# EAGLE design BUZZI-30 (EAGLE 4.15)
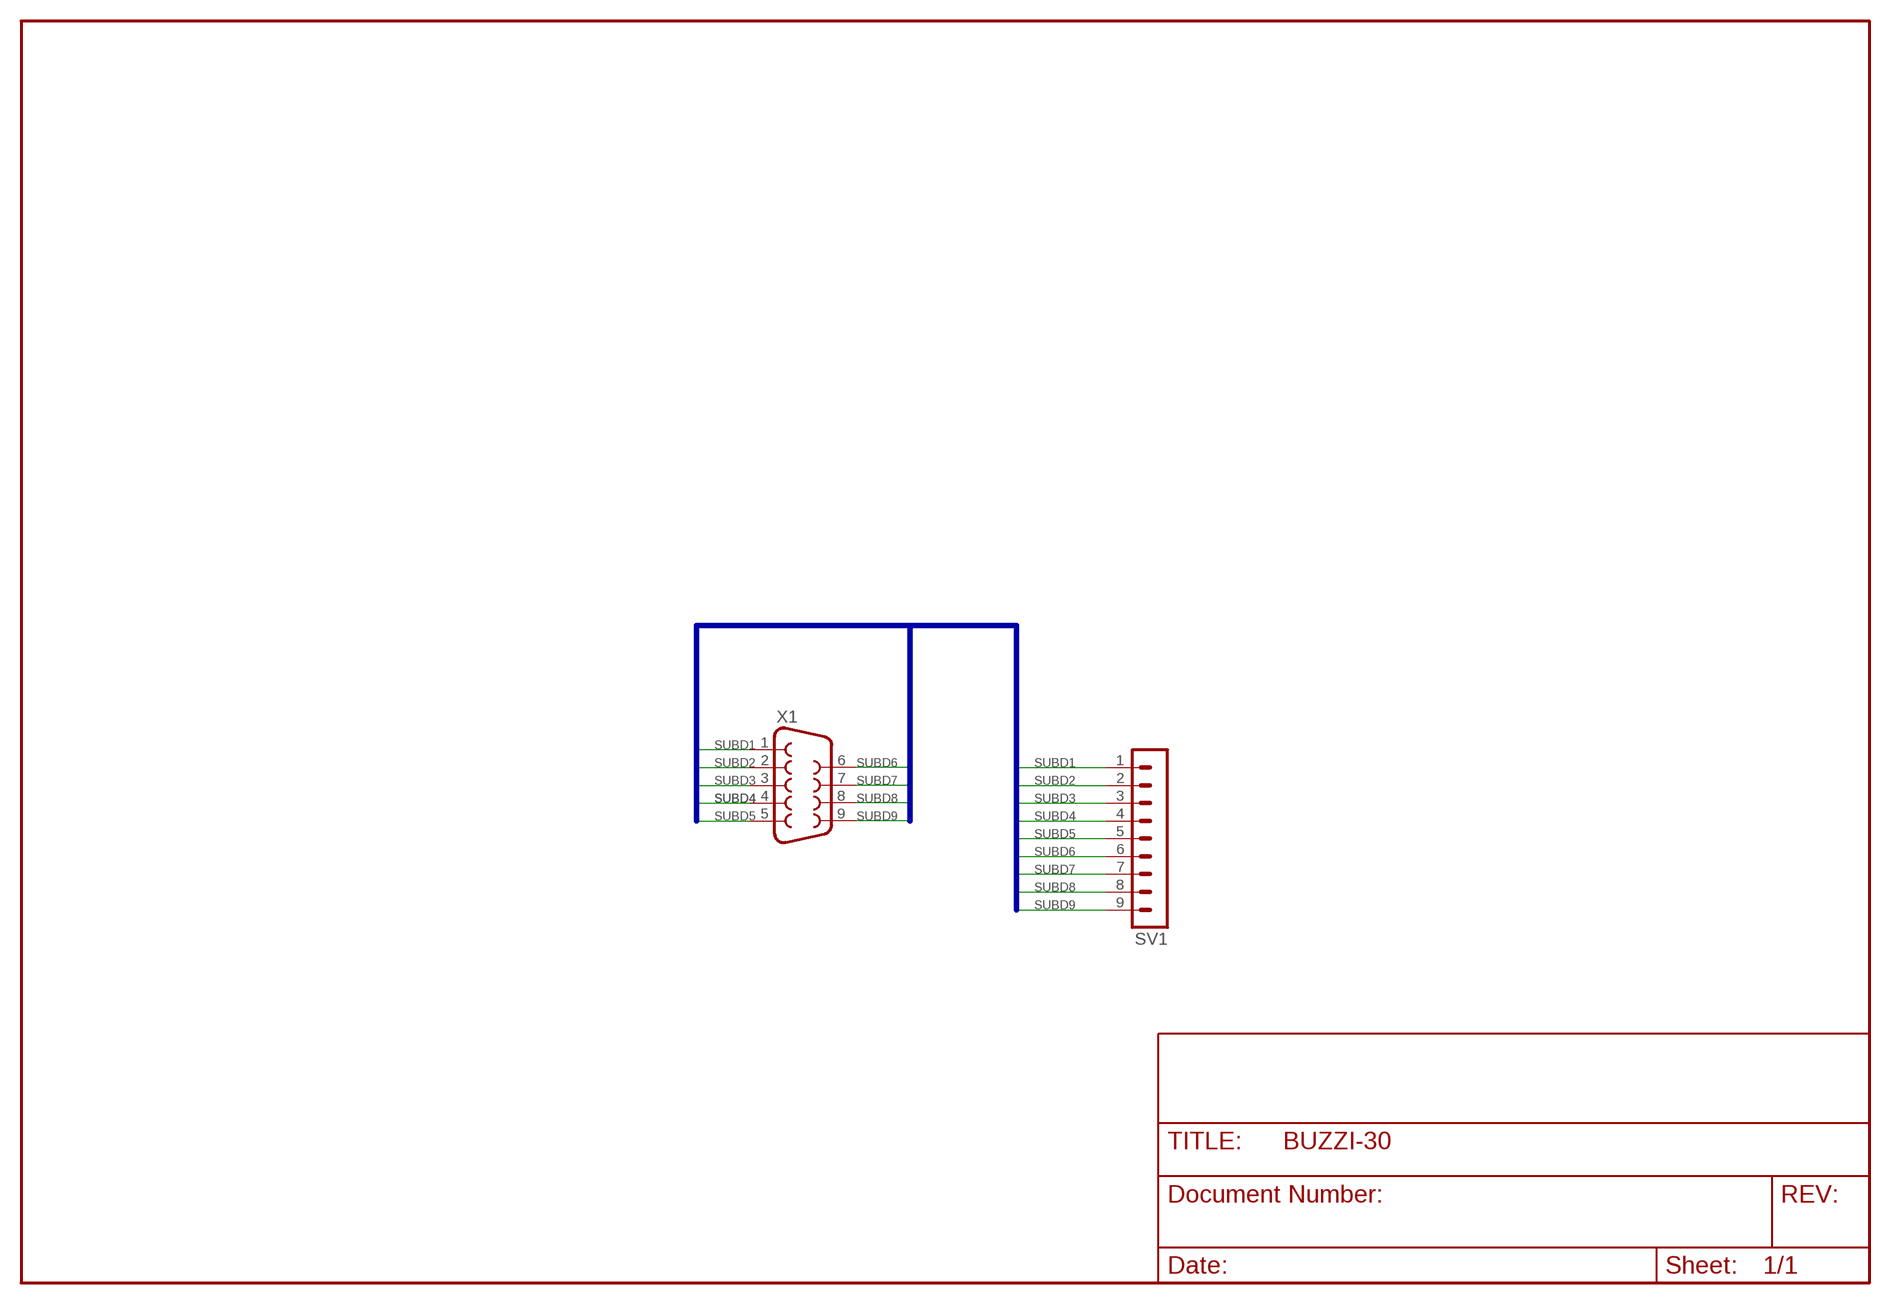
[diagram p0: schematic, sheet 1]

## Parts
SV1  MA09-1  [MA09-1]
X1  F09H  [F09H]

## Nets
SUBD1: SV1.1 X1.1
SUBD2: SV1.2 X1.2
SUBD3: SV1.3 X1.3
SUBD4: SV1.4 X1.4
SUBD5: SV1.5 X1.5
SUBD6: SV1.6 X1.6
SUBD7: SV1.7 X1.7
SUBD8: SV1.8 X1.8
SUBD9: SV1.9 X1.9

## Buses
CONNECT:SUBD[1..9],SHLD

## Library data of the parts
SV1 = con-lstb:MA09-1: PIN HEADER
X1 = con-subd:F09: SUB-D

## Net classes
0 default: width 0.5 mm

## Board
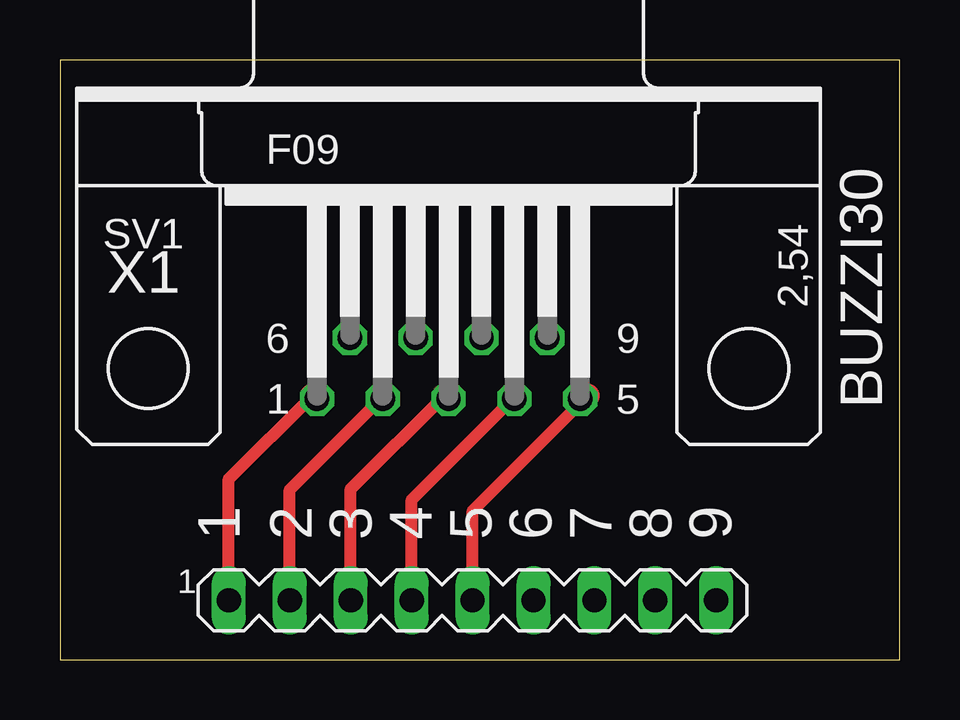
[diagram p1: board, top side]
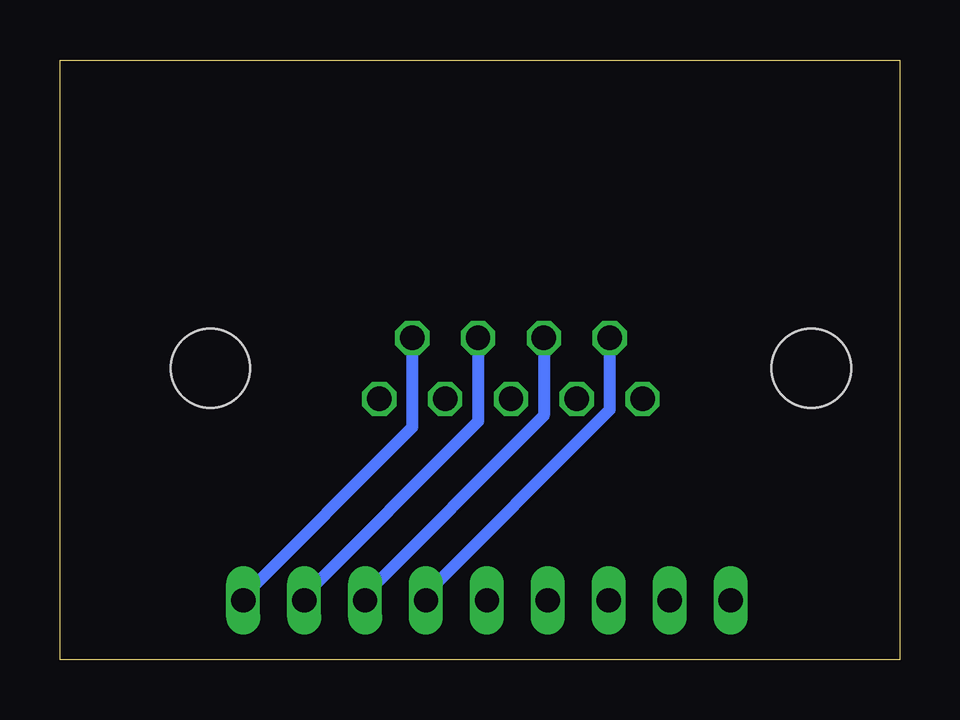
[diagram p2: board, bottom side, seen from below]

Size 35 x 25 mm. Coordinates in mm from the lower left corner, seen from the top.
Outline: 0,0 35,0 35,25 0,25 0,0
Copper layers (1*16): Top 0.035mm / dielectric 1.5mm / Bottom 0.035mm
Design rules "PCB-POOL": minimum track width 6mil, minimum drill 12mil, track to track 6mil, track to pad 6mil, pad to pad 6mil, via to via 6mil, smd to smd 6mil, copper to edge 20mil, drill to drill 8mil, minimum pad ring 8mil, minimum via ring 6mil, stop-mask expansion 3mil, vias tented up to drill 0mil, thermal gap 8mil

### Footprints (pad centres in the part's own frame; a part is rotated, then mirrored left to right if it is on the bottom)
MA09-1 = drill 1.016 long: 1 -10.16,0; 2 -7.62,0; 3 -5.08,0; 4 -2.54,0; 5 0,0; 6 2.54,0; 7 5.08,0; 8 7.62,0; 9 10.16,0
F09H = drill 1.016 octagon: 1 -5.486,-1.27; 2 -2.743,-1.27; 3 0,-1.27; 4 2.743,-1.27; 5 5.486,-1.27; 6 -4.115,1.27; 7 -1.372,1.27; 8 1.372,1.27; 9 4.115,1.27 | hole 3.302: -12.522,0; 12.522,0

### Placement (x,y rotation side)
SV1  17.2,2.47 0 top
X1  16.2,12.14 0 top

### Tracks (layer width: path | path; a pad name or v marks a point on that pad's centre or on a via)
SUBD1
  Top 0.5: SV1.1 7.04,7.54 10.5,11
  Top 1: 10.5,11 10.63,10.87 X1.1
SUBD2
  Top 0.5: SV1.2 9.58,7.08 13.46,10.96
  Top 1: 13.5,11 13.46,10.96 X1.2
SUBD3
  Top 0.5: SV1.3 12.12,7.12 16,11
  Top 1: 16,11 16.13,10.87 X1.3
SUBD4
  Top 0.5: SV1.4 14.66,6.66 18.94,10.94
  Top 1: 19,11 18.94,10.94 X1.4
SUBD5
  Top 0.5: SV1.5 17.2,6.2 21.87,10.87
  Top 1: 22,11 21.87,10.87 X1.5
SUBD6
  Bottom 0.5: SV1.6 19.97,2.47 20,2.5 12.09,10.41 X1.6
SUBD7
  Bottom 0.5: SV1.7 22.47,2.47 22.5,2.5 14.83,10.17 X1.7
SUBD8
  Bottom 0.5: SV1.8 24.97,2.47 25,2.5 17.57,9.93 X1.8
SUBD9
  Bottom 0.5: SV1.9 27.47,2.47 27.5,2.5 20.32,9.69 X1.9

### Text on the board
tNames: BUZZI30 | 1 | 2 | 3 | 4 | 5 | 6 | 7 | 8 | 9